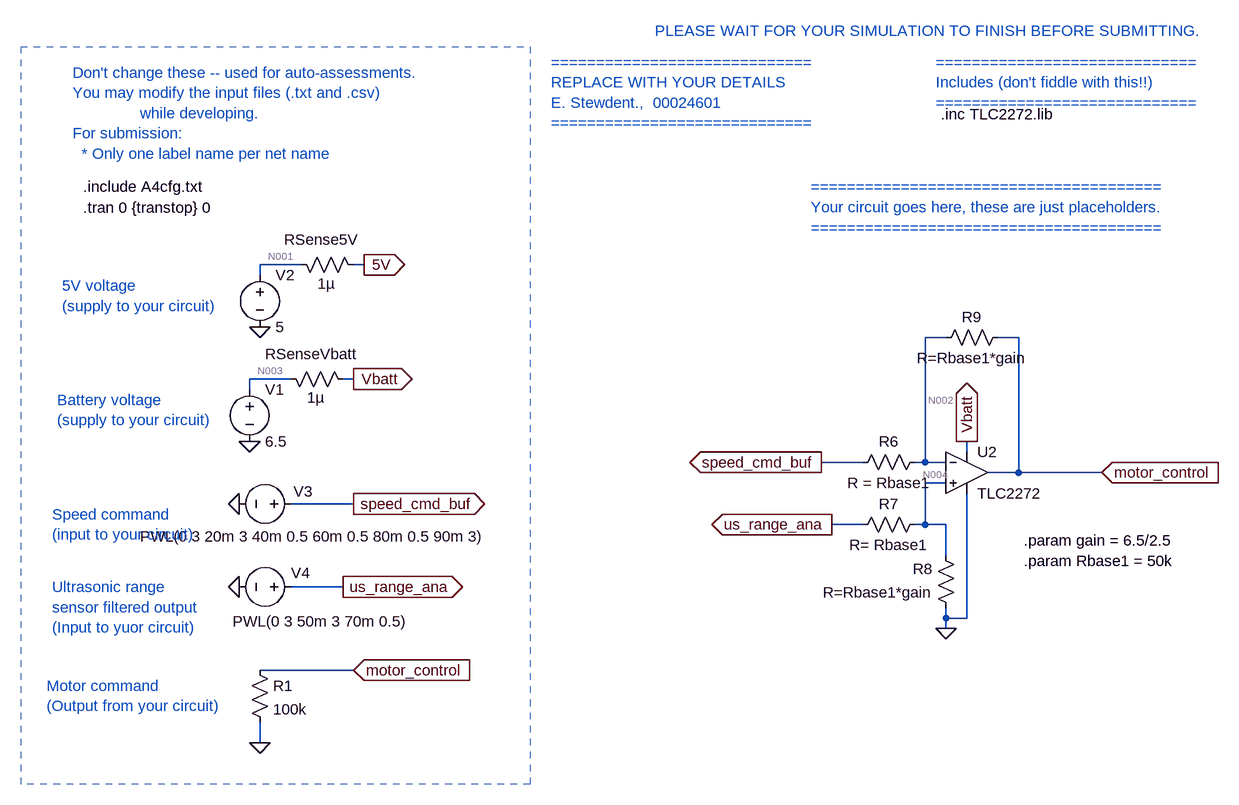
[diagram p0: schematic E344_23575786_A4a.asc]
E344_23575786_A4a.asc, the LTspice schematic file:
Version 4
SHEET 1 1824 2192
WIRE -1936 -1088 -2000 -1088
WIRE -1840 -1088 -1856 -1088
WIRE -2000 -1072 -2000 -1088
WIRE -944 -976 -976 -976
WIRE -832 -976 -864 -976
WIRE -1952 -912 -2016 -912
WIRE -1856 -912 -1872 -912
WIRE -2016 -896 -2016 -912
WIRE -912 -800 -912 -816
WIRE -1072 -784 -1136 -784
WIRE -976 -784 -976 -976
WIRE -976 -784 -992 -784
WIRE -944 -784 -976 -784
WIRE -832 -768 -832 -976
WIRE -832 -768 -880 -768
WIRE -704 -768 -832 -768
WIRE -944 -752 -976 -752
WIRE -1856 -720 -1952 -720
WIRE -1072 -688 -1120 -688
WIRE -976 -688 -976 -752
WIRE -976 -688 -992 -688
WIRE -944 -688 -976 -688
WIRE -944 -640 -944 -688
WIRE -1872 -592 -1952 -592
WIRE -944 -544 -944 -560
WIRE -912 -544 -912 -736
WIRE -912 -544 -944 -544
WIRE -944 -528 -944 -544
WIRE -1856 -464 -2000 -464
WIRE -2000 -352 -2000 -384
FLAG -1840 -1088 5V
IOPIN -1840 -1088 Out
FLAG -2000 -992 0
FLAG -1856 -912 Vbatt
IOPIN -1856 -912 Out
FLAG -2016 -816 0
FLAG -1856 -720 speed_cmd_buf
IOPIN -1856 -720 Out
FLAG -1872 -592 us_range_ana
IOPIN -1872 -592 Out
FLAG -2032 -720 0
FLAG -2032 -592 0
FLAG -1856 -464 motor_control
IOPIN -1856 -464 In
FLAG -2000 -352 0
FLAG -704 -768 motor_control
IOPIN -704 -768 In
FLAG -944 -528 0
FLAG -912 -816 Vbatt
IOPIN -912 -816 Out
FLAG -1136 -784 speed_cmd_buf
IOPIN -1136 -784 Out
FLAG -1120 -688 us_range_ana
IOPIN -1120 -688 Out
SYMBOL voltage -2000 -1088 R0
WINDOW 123 0 0 Left 0
WINDOW 39 0 0 Left 0
SYMATTR InstName V2
SYMATTR Value 5
SYMBOL res -1952 -1104 M90
WINDOW 0 -7 47 VBottom 2
WINDOW 3 29 54 VTop 2
SYMATTR InstName RSense5V
SYMATTR Value 1µ
SYMBOL voltage -2016 -912 R0
WINDOW 123 0 0 Left 0
WINDOW 39 0 0 Left 0
SYMATTR InstName V1
SYMATTR Value 6.5
SYMBOL res -1968 -928 M90
WINDOW 0 -7 47 VBottom 2
WINDOW 3 29 54 VTop 2
SYMATTR InstName RSenseVbatt
SYMATTR Value 1µ
SYMBOL voltage -1936 -720 R90
WINDOW 123 0 0 Left 0
WINDOW 39 0 0 Left 0
WINDOW 0 -19 -17 VRight 2
WINDOW 3 50 -286 VRight 2
SYMATTR InstName V3
SYMATTR Value PWL(0 3 20m 3 40m 0.5 60m 0.5 80m 0.5 90m 3)
SYMBOL voltage -1936 -592 R90
WINDOW 123 0 0 Left 0
WINDOW 39 0 0 Left 0
WINDOW 0 -22 -13 VRight 2
WINDOW 3 53 -165 VRight 2
SYMATTR InstName V4
SYMATTR Value PWL(0 3 50m 3 70m 0.5)
SYMBOL res -2016 -480 R0
SYMATTR InstName R1
SYMATTR Value 100k
SYMBOL res -976 -800 R90
WINDOW 0 0 56 VBottom 2
WINDOW 3 32 56 VTop 2
SYMATTR InstName R6
SYMATTR Value R = Rbase1
SYMBOL res -976 -704 R90
WINDOW 0 0 56 VBottom 2
WINDOW 3 32 56 VTop 2
SYMATTR InstName R7
SYMATTR Value R= Rbase1
SYMBOL res -928 -544 R180
WINDOW 0 36 76 Left 2
WINDOW 3 36 40 Left 2
SYMATTR InstName R8
SYMATTR Value R=Rbase1*gain
SYMBOL res -960 -960 R270
WINDOW 0 32 56 VTop 2
WINDOW 3 0 56 VBottom 2
SYMATTR InstName R9
SYMATTR Value R=Rbase1*gain
SYMBOL Opamps\\opamp2 -912 -832 R0
SYMATTR InstName U2
SYMATTR Value TLC2272
SYMATTR SpiceModel TLC2272
TEXT -2288 -1384 Left 2 ;Don't change these -- used for auto-assessments.\nYou may modify the input files (.txt and .csv) \n               while developing.\nFor submission: \n  * Only one label name per net name
TEXT -1552 -1400 Left 2 ;=============================\nREPLACE WITH YOUR DETAILS\nE. Stewdent.,  00024601\n=============================
TEXT -960 -1400 Left 2 ;=============================\nIncludes (don't fiddle with this!!)\n=============================
TEXT -1152 -1208 Left 2 ;=======================================\nYour circuit goes here, these are just placeholders.\n=======================================
TEXT -1392 -1448 Left 2 ;PLEASE WAIT FOR YOUR SIMULATION TO FINISH BEFORE SUBMITTING.
TEXT -2272 -1176 Left 2 !.tran 0 {transtop} 0
TEXT -2272 -1208 Left 2 !.include A4cfg.txt
TEXT -2320 -704 Left 2 ;Speed command\n(input to your circuit)
TEXT -2320 -592 Left 2 ;Ultrasonic range\nsensor filtered output\n(Input to yuor circuit)
TEXT -2328 -440 Left 2 ;Motor command\n(Output from your circuit)
TEXT -2312 -880 Left 2 ;Battery voltage \n(supply to your circuit)
TEXT -2304 -1056 Left 2 ;5V voltage \n(supply to your circuit)
TEXT -824 -632 Left 2 !.param Rbase1 = 50k
TEXT -824 -664 Left 2 !.param gain = 6.5/2.5
TEXT -952 -1320 Left 2 !.inc TLC2272.lib
LINE Normal -1584 -1424 -1584 -288 2
LINE Normal -2368 -1424 -1584 -1424 2
LINE Normal -1584 -288 -2368 -288 2
LINE Normal -1584 -304 -1584 -304 2
LINE Normal -2368 -1424 -2368 -288 2

The netlist it stands for:
* E344_23575786_A4a.asc
V2 N001 0 5
RSense5V N001 5V 1µ
V1 N003 0 6.5
RSenseVbatt N003 Vbatt 1µ
V3 speed_cmd_buf 0 PWL(0 3 20m 3 40m 0.5 60m 0.5 80m 0.5 90m 3)
V4 us_range_ana 0 PWL(0 3 50m 3 70m 0.5)
R1 motor_control 0 100k
R6 N002 speed_cmd_buf R = Rbase1
R7 N004 us_range_ana R= Rbase1
R8 0 N004 R=Rbase1*gain
R9 N002 motor_control R=Rbase1*gain
XU2 N004 N002 Vbatt 0 motor_control TLC2272 TLC2272  ; pins In+ In- V+ V- OUT
* Don't change these -- used for auto-assessments.
* You may modify the input files (.txt and .csv)
*                while developing.
* For submission:
*   * Only one label name per net name
* =============================
* REPLACE WITH YOUR DETAILS
* E. Stewdent.,  00024601
* =============================
* =============================
* Includes (don't fiddle with this!!)
* =============================
* =======================================
* Your circuit goes here, these are just placeholders.
* =======================================
* PLEASE WAIT FOR YOUR SIMULATION TO FINISH BEFORE SUBMITTING.
.tran 0 {transtop} 0
.include A4cfg.txt
* Speed command
* (input to your circuit)
* Ultrasonic range
* sensor filtered output
* (Input to yuor circuit)
* Motor command
* (Output from your circuit)
* Battery voltage
* (supply to your circuit)
* 5V voltage
* (supply to your circuit)
.param Rbase1 = 50k
.param gain = 6.5/2.5
.inc TLC2272.lib
.backanno
.end

* Results of the author's LTspice run, read from the files saved beside the schematic
* Operating Point, zero values left out:
*   V(n001) = 5 V
*   V(5v) = 5 V
*   V(n003) = 6.5 V
*   V(vbatt) = 6.5 V
*   V(speed_cmd_buf) = 3 V
*   V(us_range_ana) = 3 V
*   V(motor_control) = 11.92 mV
*   V(n002) = 2.17 V
*   V(n004) = 2.167 V
*   I(R9) = 16.6 µA
*   I(R8) = -16.67 µA
*   I(R7) = -16.67 µA
*   I(R6) = -16.6 µA
*   I(R1) = 119.2 nA
*   I(Rsensevbatt) = 2.4 mA
*   I(V4) = -16.67 µA
*   I(V3) = -16.6 µA
*   I(V1) = -2.4 mA
*   Ix(u2:IN+) = -1.021 pA
*   Ix(u2:IN-) = -1.776 pA
*   Ix(u2:VCC) = 2.4 mA
*   Ix(u2:VEE) = -2.416 mA
*   Ix(u2:OUT) = 16.48 µA
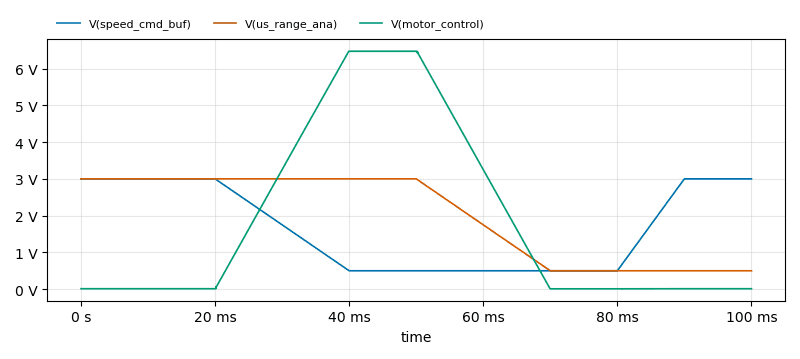
[diagram p1: Transient Analysis of E344_23575786_A4a.asc, plotted from the saved traces]
* Transient Analysis, 1 run:
*   V(speed_cmd_buf): min 500 mV, max 3 V, average 1.625 V, rms 1.995 V, last 3 V
*   V(us_range_ana): min 500 mV, max 3 V, average 2 V, rms 2.343 V, last 500 mV
*   V(motor_control): min 8.751 mV, max 6.47 V, average 1.952 V, rms 3.364 V, last 11.9 mV